# EAGLE design platine2 (EAGLE 4.16)
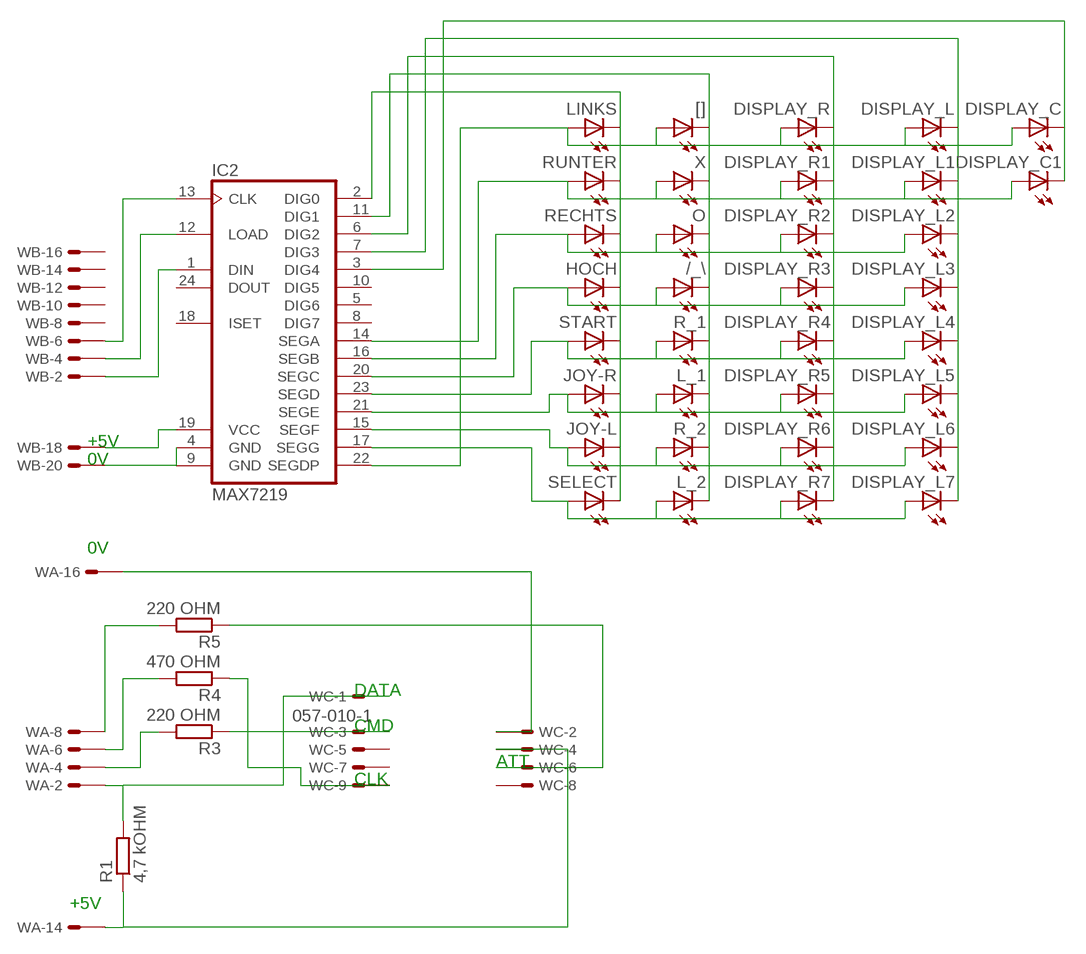
[diagram p0: schematic, sheet 1]

## Parts
/_\  LED5MM  [LED5MM]
[]  LED5MM  [LED5MM]
DISPLAY_C  LED5MM  [LED5MM]
DISPLAY_C1  LED5MM  [LED5MM]
DISPLAY_L  LED5MM  [LED5MM]
DISPLAY_L1  LED5MM  [LED5MM]
DISPLAY_L2  LED5MM  [LED5MM]
DISPLAY_L3  LED5MM  [LED5MM]
DISPLAY_L4  LED5MM  [LED5MM]
DISPLAY_L5  LED5MM  [LED5MM]
DISPLAY_L6  LED5MM  [LED5MM]
DISPLAY_L7  LED5MM  [LED5MM]
DISPLAY_R  LED5MM  [LED5MM]
DISPLAY_R1  LED5MM  [LED5MM]
DISPLAY_R2  LED5MM  [LED5MM]
DISPLAY_R3  LED5MM  [LED5MM]
DISPLAY_R4  LED5MM  [LED5MM]
DISPLAY_R5  LED5MM  [LED5MM]
DISPLAY_R6  LED5MM  [LED5MM]
DISPLAY_R7  LED5MM  [LED5MM]
HOCH  LED5MM  [LED5MM]
IC2  MAX7219  MAX7219CNG  [DIL24-3]
JOY-L  LED5MM  [LED5MM]
JOY-R  LED5MM  [LED5MM]
L_1  LED5MM  [LED5MM]
L_2  LED5MM  [LED5MM]
LINKS  LED5MM  [LED5MM]
O  LED5MM  [LED5MM]
R1  4,7 kOHM  R-R0805  [R0805]
R3  220 OHM  R-R0805  [R0805]
R4  470 OHM  R-R0805  [R0805]
R5  220 OHM  R-R0805  [R0805]
R_1  LED5MM  [LED5MM]
R_2  LED5MM  [LED5MM]
RECHTS  LED5MM  [LED5MM]
RUNTER  LED5MM  [LED5MM]
SELECT  LED5MM  [LED5MM]
START  LED5MM  [LED5MM]
WA  057-016-1  [057-016-1]
WB  057-020-1  [057-020-1]
WC  057-010-1  [057-010-1]
X  LED5MM  [LED5MM]

## Nets
N$1: R1.2 WA.2 WC.1
N$3: R3.2 WA.4
N$4: R4.2 WA.6
N$5: R5.2 WA.8
N$6: R1.1 WA.14 WC.4
N$11: IC2.4(GND) IC2.9(GND) WB.20
N$16: R3.1 WC.3
N$17: R4.1 WC.9
N$18: R5.1 WC.6
N$19: WA.16 WC.2
N$20: IC2.19(VCC) WB.18
N$21: IC2.1(DIN) WB.2
N$22: IC2.12(LOAD) WB.4
N$23: IC2.13(CLK) WB.6
N$31: [].A DISPLAY_C.A DISPLAY_L.A DISPLAY_R.A IC2.22(SEGDP) LINKS.A
N$32: DISPLAY_C1.A DISPLAY_L1.A DISPLAY_R1.A IC2.14(SEGA) RUNTER.A X.A
N$33: DISPLAY_L2.A DISPLAY_R2.A IC2.16(SEGB) O.A RECHTS.A
N$34: /_\.A DISPLAY_L3.A DISPLAY_R3.A HOCH.A IC2.20(SEGC)
N$35: DISPLAY_L4.A DISPLAY_R4.A IC2.23(SEGD) R_1.A START.A
N$36: DISPLAY_L5.A DISPLAY_R5.A IC2.21(SEGE) JOY-R.A L_1.A
N$37: DISPLAY_L6.A DISPLAY_R6.A IC2.15(SEGF) JOY-L.A R_2.A
N$38: DISPLAY_L7.A DISPLAY_R7.A IC2.17(SEGG) L_2.A SELECT.A
N$39: HOCH.K(C) IC2.2(DIG0) JOY-L.K(C) JOY-R.K(C) LINKS.K(C) RECHTS.K(C) RUNTER.K(C) SELECT.K(C) START.K(C)
N$40: /_\.K(C) [].K(C) IC2.11(DIG1) L_1.K(C) L_2.K(C) O.K(C) R_1.K(C) R_2.K(C) X.K(C)
N$41: DISPLAY_R1.K(C) DISPLAY_R2.K(C) DISPLAY_R3.K(C) DISPLAY_R4.K(C) DISPLAY_R5.K(C) DISPLAY_R6.K(C) DISPLAY_R7.K(C) DISPLAY_R.K(C) IC2.6(DIG2)
N$42: DISPLAY_L1.K(C) DISPLAY_L2.K(C) DISPLAY_L3.K(C) DISPLAY_L4.K(C) DISPLAY_L5.K(C) DISPLAY_L6.K(C) DISPLAY_L7.K(C) DISPLAY_L.K(C) IC2.7(DIG3)
N$43: DISPLAY_C1.K(C) DISPLAY_C.K(C) IC2.3(DIG4)
Unconnected: IC2.5(DIG6) IC2.8(DIG7) IC2.10(DIG5) IC2.18(ISET) IC2.24(DOUT) WA.1 WA.3 WA.5 WA.7 WA.9 WA.10 WA.11 WA.12 WA.13 WA.15 WB.1 WB.3 WB.5 WB.7 WB.8 WB.9 WB.10 WB.11 WB.12 WB.13 WB.14 WB.15 WB.16 WB.17 WB.19 WC.5 WC.7 WC.8 WC.10

## Notes on the sheet
- +5V
- 0V
- 0V
- DATA
- CMD
- ATT
- CLK
- +5V

## Library data of the parts
/_\ [] DISPLAY_C DISPLAY_C1 DISPLAY_L DISPLAY_L1-DISPLAY_L7 DISPLAY_R DISPLAY_R1-DISPLAY_R7 HOCH JOY-L JOY-R L_1 L_2 LINKS O R_1 R_2 RECHTS RUNTER SELECT START X = led:LED: LED OSRAM: - CHIPLED LG R971, LG N971, LY N971, LG Q971, LY Q971, LO R971, LY R971 LH N974, LH R974 LS Q976, LO Q976, LY Q976 LO Q996 - Hyper CHIPLED LW Q18S LB Q993, LB Q99A, LB R99A - SideLED LS A670, LO A670, LY A670, LG A670, LP A670 LB A673, LV A673, LT A673, LW A673 LH A674 LY A675 LS A676, LA A676, LO A676, LY A676, LW A676 LS A679, LY A679, LG A679 - Hyper Micro SIDELED® LS Y876, LA Y876, LO Y876, LY Y876 LT Y87S - SmartLED LW L88C, LW L88S LB L89C, LB L89S, LG L890 LS L89K, LO L89K, LY L89K LS L896, LA L896, LO L896, LY L896 - TOPLED LS T670, LO T670, LY T670, LG T670, LP T670 LSG T670, LSP T670, LSY T670, LOP T670, LYG T670 LG T671, LOG T671, LSG T671 LB T673, LV T673, LT T673, LW T673 LH T674 LS T676, LA T676, LO T676, LY T676, LB T676, LH T676, LSB T676, LW T676 LB T67C, LV T67C, LT T67C, LS T67K, LO T67K, LY T67K, LW E67C LS E67B, LA E67B, LO E67B, LY E67B, LB E67C, LV E67C, LT E67C LW T67C LS T679, LY T679, LG T679 LS T770, LO T770, LY T770, LG T770, LP T770 LB T773, LV T773, LT T773, LW T773 LH T774 LS E675, LA E675, LY E675, LS T675 LS T776, LA T776, LO T776, LY T776, LB T776 LHGB T686 LT T68C, LB T68C - Hyper Mini TOPLED® LB M676 - Mini TOPLED Santana® LG M470 LS M47K, LO M47K, LY M47K Source: http://www.osram.convergy.de - LUMILED® LXK2-PW12-R00, LXK2-PW12-S00, LXK2-PW14-U00, LXK2-PW14-V00 LXK2-PM12-R00, LXK2-PM12-S00, LXK2-PM14-U00 LXK2-PE12-Q00, LXK2-PE12-R00, LXK2-PE12-S00, LXK2-PE14-T00, LXK2-PE14-U00 LXK2-PB12-K00, LXK2-PB12-L00, LXK2-PB12-M00, LXK2-PB14-N00, LXK2-PB14-P00, LXK2-PB14-Q00 LXK2-PR12-L00, LXK2-PR12-M00, LXK2-PR14-Q00, LXK2-PR14-R00 LXK2-PD12-Q00, LXK2-PD12-R00, LXK2-PD12-S00 LXK2-PH12-R00, LXK2-PH12-S00 LXK2-PL12-P00, LXK2-PL12-Q00, LXK2-PL12-R00 Source: www.luxeon.com
IC2 = maxim:MAX7219CNG: LED DISPLAY DRIVER
R1 R3-R5 = quantum-sensor:R: Resistor
WA = con-panduit:057-016-: CONNECTOR 10-pin series 057 contact pc board low profile headers
WB = con-panduit:057-020-: CONNECTOR 20-pin series 057 contact pc board low profile headers
WC = con-panduit:057-010-: CONNECTOR 10-pin series 057 contact pc board low profile headers

## Board
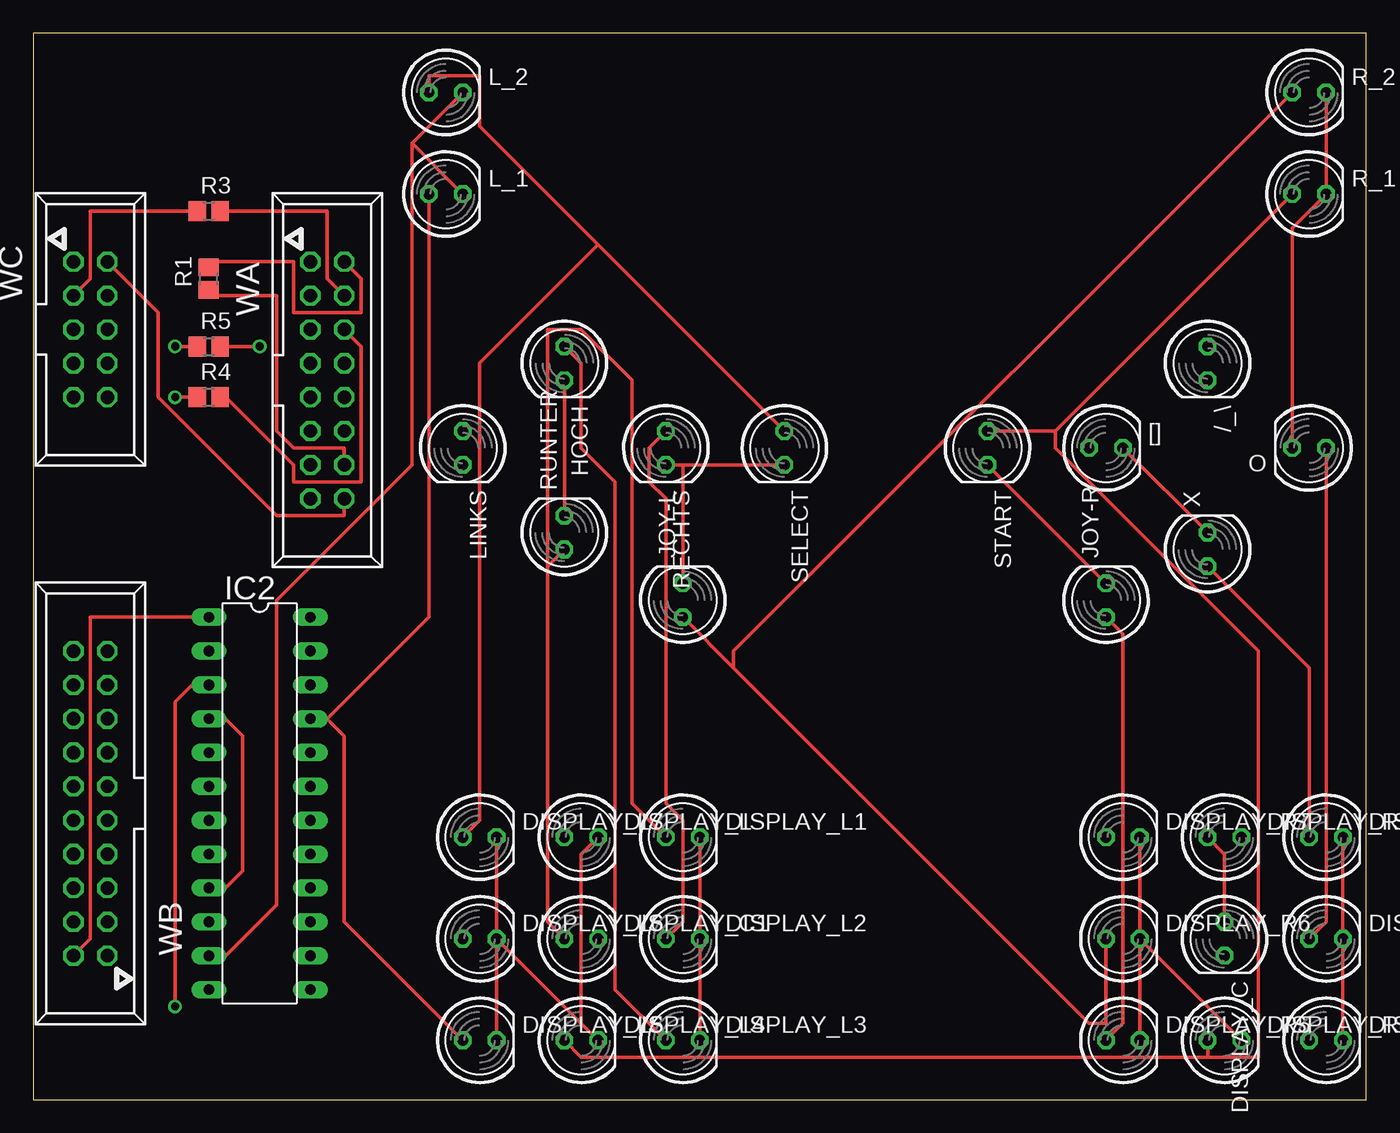
[diagram p1: board, top side]
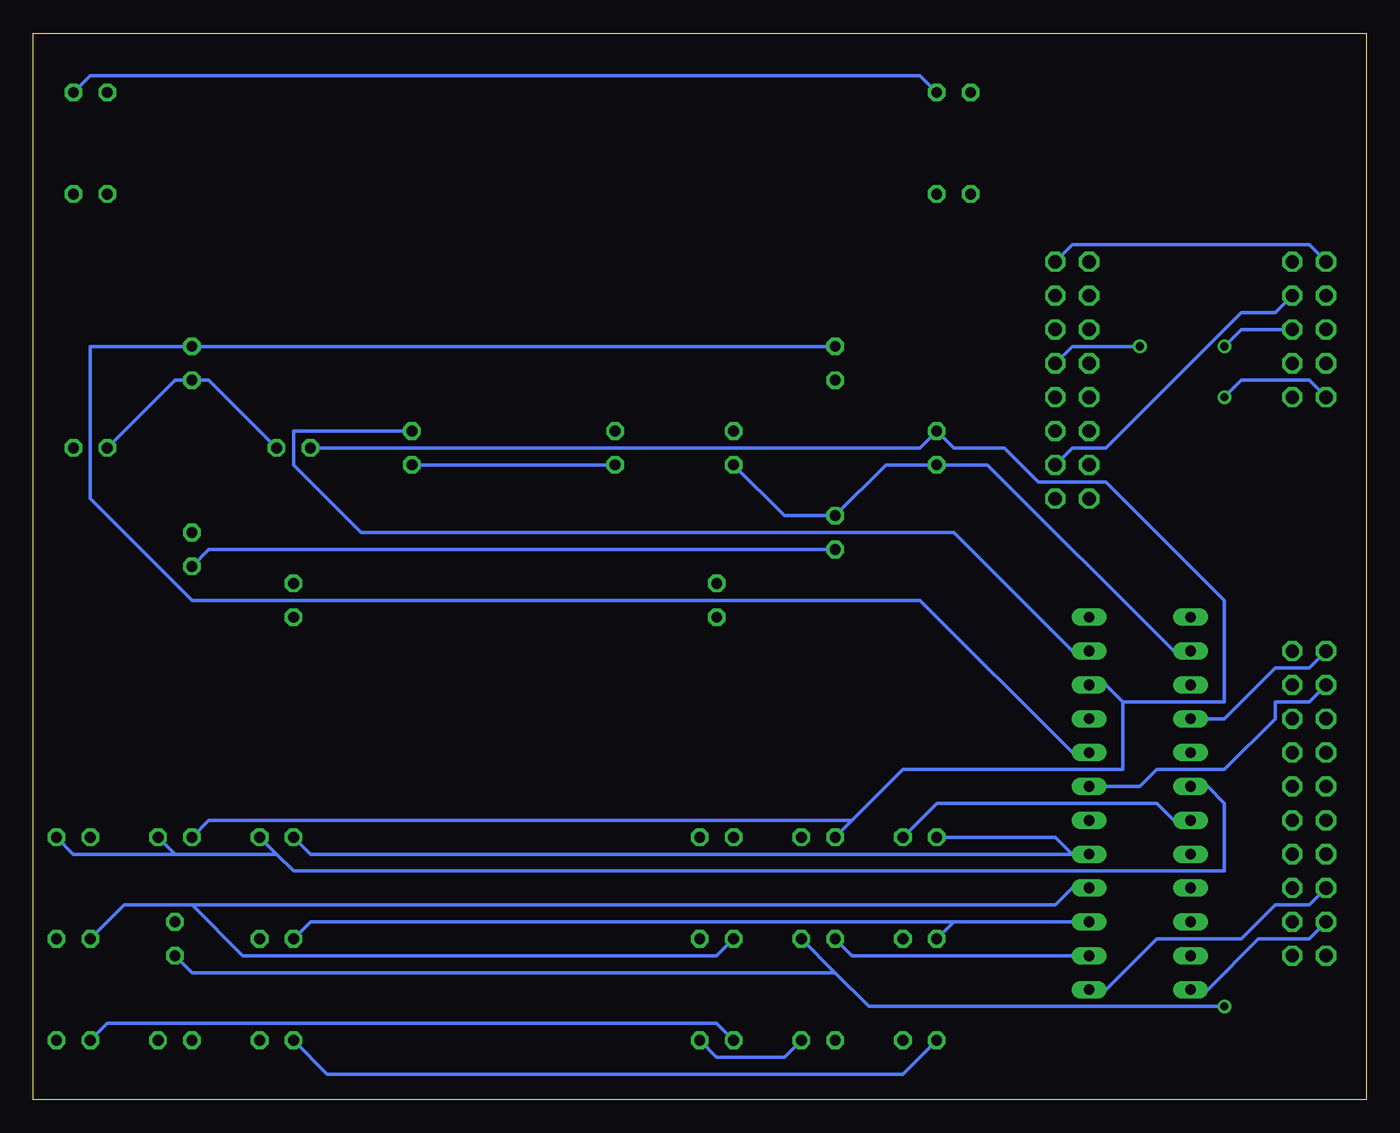
[diagram p2: board, bottom side, seen from below]

Size 100 x 80 mm. Coordinates in mm from the lower left corner, seen from the top.
Outline: 0,0 100,0 100,80 0,80 0,0
Copper layers (1*16): Top 0.035mm / dielectric 1.5mm / Bottom 0.035mm
Design rules "default": minimum track width 10mil, minimum drill 24mil, track to track 8mil, track to pad 8mil, pad to pad 8mil, via to via 8mil, smd to smd 8mil, copper to edge 40mil, drill to drill 8mil, minimum pad ring 10mil, minimum via ring 8mil, stop-mask expansion 4mil, vias tented up to drill 0mil, thermal gap 10mil

### Footprints (pad centres in the part's own frame; a part is rotated, then mirrored left to right if it is on the bottom)
LED5MM = drill 0.813 octagon: A -1.27,0; K 1.27,0
DIL24-3 = drill 0.813 long: 1 -13.97,-3.81; 2 -11.43,-3.81; 3 -8.89,-3.81; 4 -6.35,-3.81; 5 -3.81,-3.81; 6 -1.27,-3.81; 7 1.27,-3.81; 8 3.81,-3.81; 9 6.35,-3.81; 10 8.89,-3.81; 11 11.43,-3.81; 12 13.97,-3.81; 13 13.97,3.81; 14 11.43,3.81; 15 8.89,3.81; 16 6.35,3.81; 17 3.81,3.81; 18 1.27,3.81; 19 -1.27,3.81; 20 -3.81,3.81; 21 -6.35,3.81; 22 -8.89,3.81; 23 -11.43,3.81; 24 -13.97,3.81
R0805 = smd 1.3 x 1.5: 1 -0.85,0; 2 0.85,0
057-016-1 = drill 1 octagon: 1 -8.89,-1.27; 2 -8.89,1.27; 3 -6.35,-1.27; 4 -6.35,1.27; 5 -3.81,-1.27; 6 -3.81,1.27; 7 -1.27,-1.27; 8 -1.27,1.27; 9 1.27,-1.27; 10 1.27,1.27; 11 3.81,-1.27; 12 3.81,1.27; 13 6.35,-1.27; 14 6.35,1.27; 15 8.89,-1.27; 16 8.89,1.27
057-020-1 = drill 1 octagon: 1 -11.43,-1.27; 2 -11.43,1.27; 3 -8.89,-1.27; 4 -8.89,1.27; 5 -6.35,-1.27; 6 -6.35,1.27; 7 -3.81,-1.27; 8 -3.81,1.27; 9 -1.27,-1.27; 10 -1.27,1.27; 11 1.27,-1.27; 12 1.27,1.27; 13 3.81,-1.27; 14 3.81,1.27; 15 6.35,-1.27; 16 6.35,1.27; 17 8.89,-1.27; 18 8.89,1.27; 19 11.43,-1.27; 20 11.43,1.27
057-010-1 = drill 1 octagon: 1 -5.08,-1.27; 2 -5.08,1.27; 3 -2.54,-1.27; 4 -2.54,1.27; 5 0,-1.27; 6 0,1.27; 7 2.54,-1.27; 8 2.54,1.27; 9 5.08,-1.27; 10 5.08,1.27

### Placement (x,y rotation side)
/_\  88.1,55.24 270 top
[]  80.48,48.89 0 top
DISPLAY_C  89.37,12.06 270 top
DISPLAY_C1  41.11,12.06 0 top
DISPLAY_L  41.11,19.68 0 top
DISPLAY_L1  48.73,19.68 0 top
DISPLAY_L2  48.73,12.06 0 top
DISPLAY_L3  48.73,4.44 0 top
DISPLAY_L4  41.11,4.44 0 top
DISPLAY_L5  33.49,4.44 0 top
DISPLAY_L6  33.49,12.06 0 top
DISPLAY_L7  33.49,19.68 0 top
DISPLAY_R  89.37,19.68 0 top
DISPLAY_R1  96.99,19.68 0 top
DISPLAY_R2  96.99,12.06 0 top
DISPLAY_R3  96.99,4.44 0 top
DISPLAY_R4  89.37,4.44 0 top
DISPLAY_R5  81.75,4.44 0 top
DISPLAY_R6  81.75,12.06 0 top
DISPLAY_R7  81.75,19.68 0 top
HOCH  39.84,55.24 270 top
IC2  16.98,22.22 270 top
JOY-L  48.73,37.46 90 top
JOY-R  80.48,37.46 90 top
L_1  30.95,67.94 0 top
L_2  30.95,75.56 0 top
LINKS  32.22,48.89 270 top
O  95.72,48.89 180 top
R1  13.17,61.59 90 top
R3  13.17,66.67 0 top
R4  13.17,52.7 0 top
R5  13.17,56.51 0 top
R_1  95.72,67.94 0 top
R_2  95.72,75.56 0 top
RECHTS  47.46,48.89 270 top
RUNTER  39.84,42.54 90 top
SELECT  56.35,48.89 270 top
START  71.59,48.89 270 top
WA  22.06,53.97 270 top
WB  4.28,22.22 90 top
WC  4.28,57.78 270 top
X  88.1,41.27 90 top

### Tracks (layer width: path | path; a pad name or v marks a point on that pad's centre or on a via)
N$1
  Top 0.254: WA.2 24.6,61.59 24.6,59.05 19.52,59.05 19.52,62.86 13.17,62.86 R1.2
  Bottom 0.254: WC.1 4.28,64.13 22.06,64.13 WA.2
N$3
  Top 0.254: WA.4 22.06,61.59 22.06,66.67 R3.2
N$4
  Top 0.254: WA.6 24.6,56.51 24.6,46.35 19.52,46.35 19.52,47.62 14.44,52.7 R4.2
N$5  (via drill 0.61)
  Top 0.254: R5.2 v16.98,56.51
  Bottom 0.254: v16.98,56.51 22.06,56.51 WA.8
N$6
  Top 0.254: WA.14 23.33,48.89 19.52,48.89 18.25,50.16 18.25,60.32 13.17,60.32 R1.1
  Bottom 0.254: WC.4 6.82,59.05 9.36,59.05 19.52,48.89 22.06,48.89 WA.14
N$11
  Top 0.254: IC2.9 14.44,15.87 15.71,17.14 15.71,27.3 14.44,28.57 IC2.4
  Bottom 0.254: WB.20 4.28,32.38 6.82,32.38 10.63,28.57 IC2.4
N$16
  Top 0.254: WC.3 4.28,61.59 4.28,66.67 R3.1
N$17  (via drill 0.61)
  Top 0.254: v10.63,52.7 R4.1
  Bottom 0.254: v10.63,52.7 9.36,53.97 4.28,53.97 WC.9
N$18  (via drill 0.61)
  Top 0.254: v10.63,56.51 R5.1
  Bottom 0.254: v10.63,56.51 9.36,57.78 WC.6
N$19
  Top 0.254: WC.2 9.36,59.05 9.36,52.7 18.25,43.81 23.33,43.81 WA.16
N$20
  Bottom 0.254: WB.18 4.28,29.84 6.82,29.84 6.82,28.57 10.63,24.76 15.71,24.76 16.98,23.49 IC2.19
N$21
  Top 0.254: WB.2 4.28,12.06 4.28,36.19 IC2.1
N$22
  Bottom 0.254: WB.4 4.28,12.06 8.09,12.06 11.9,8.25 IC2.12
N$23
  Bottom 0.254: WB.6 4.28,14.6 6.82,14.6 9.36,12.06 15.71,12.06 19.52,8.25 IC2.13
N$31
  Top 0.254: DISPLAY_R.A 89.37,18.41 DISPLAY_C.A
  Bottom 0.254: [].A 33.49,48.89 LINKS.A 30.95,48.89 27.14,48.89 24.6,46.35 19.52,46.35 10.63,37.46 10.63,29.84 18.25,29.84 | 18.25,29.84 19.52,31.11 IC2.22 | 18.25,29.84 18.25,24.76 34.76,24.76 38.57,20.95 | 38.57,20.95 DISPLAY_L.A | DISPLAY_R.A 86.83,20.95 38.57,20.95
N$32
  Top 0.254: X.A 95.72,32.38 DISPLAY_R1.A | 38.57,40 RUNTER.A | 38.57,40 38.57,13.33 DISPLAY_C1.A | DISPLAY_L1.A 44.92,22.22 44.92,53.97 41.11,57.78 38.57,57.78 38.57,40
  Bottom 0.254: DISPLAY_C1.A 38.57,10.79 IC2.14 | X.A 86.83,41.27 RUNTER.A
N$33
  Top 0.254: O.A 96.99,13.33 DISPLAY_R2.A | RECHTS.A 46.19,48.89 46.19,46.35 47.46,45.08 47.46,22.22 48.73,20.95 48.73,13.33 DISPLAY_L2.A
  Bottom 0.254: 88.1,14.6 93.18,14.6 DISPLAY_R2.A | 88.1,14.6 23.33,14.6 22.06,15.87 IC2.16 | DISPLAY_L2.A 48.73,10.79 84.29,10.79 88.1,14.6
N$34
  Top 0.254: DISPLAY_L3.A 43.65,8.25 43.65,46.35 41.11,48.89 41.11,55.24 HOCH.A
  Bottom 0.254: DISPLAY_L3.A 48.73,5.71 94.45,5.71 DISPLAY_R3.A | IC2.20 22.06,26.03 33.49,37.46 88.1,37.46 95.72,45.08 95.72,56.51 /_\.A HOCH.A
N$35
  Top 0.254: DISPLAY_L4.A 41.11,3.17 88.1,3.17 | 88.1,3.17 DISPLAY_R4.A | 76.67,50.16 R_1.A | 76.67,50.16 START.A | 88.1,3.17 91.91,3.17 91.91,33.65 76.67,48.89 76.67,50.16
  Bottom 0.254: START.A 80.48,50.16 80.48,47.62 75.4,42.54 30.95,42.54 22.06,33.65 IC2.23
N$36
  Top 0.254: DISPLAY_R5.A 81.75,5.71 81.75,34.92 JOY-R.A | DISPLAY_L5.A 23.33,13.33 23.33,27.3 22.06,28.57 | L_1.A 29.68,36.19 22.06,28.57 | 22.06,28.57 IC2.21
  Bottom 0.254: DISPLAY_R5.A 77.94,1.9 34.76,1.9 DISPLAY_L5.A
N$37
  Top 0.254: 52.54,32.38 79.21,5.71 80.48,5.71 DISPLAY_R6.A | 52.54,32.38 JOY-L.A | R_2.A 52.54,33.65 52.54,32.38
  Bottom 0.254: 30.95,13.33 DISPLAY_L6.A | IC2.15 30.95,13.33 | DISPLAY_R6.A 79.21,13.33 30.95,13.33
N$38
  Top 0.254: 42.38,64.13 33.49,73.02 33.49,76.83 29.68,76.83 L_2.A | 42.38,64.13 SELECT.A | 42.38,64.13 33.49,55.24 33.49,20.95 DISPLAY_L7.A
  Bottom 0.254: 22.06,18.41 23.33,19.68 DISPLAY_L7.A | DISPLAY_R7.A 79.21,18.41 22.06,18.41 | IC2.17 22.06,18.41
N$39
  Top 0.254: START.K JOY-R.K | 48.73,47.62 SELECT.K | RECHTS.K 48.73,47.62 | 48.73,47.62 JOY-L.K | RUNTER.K HOCH.K
  Bottom 0.254: IC2.2 14.44,33.65 28.41,47.62 LINKS.K 36.03,47.62 RUNTER.K 43.65,43.81 RECHTS.K | SELECT.K START.K
N$40
  Top 0.254: R_2.K R_1.K 94.45,65.4 O.K | [].K X.K | 28.41,71.75 28.41,47.62 18.25,37.46 18.25,14.6 14.44,10.79 IC2.11 | 28.41,71.75 L_2.K | 28.41,71.75 L_1.K
  Bottom 0.254: [].K 86.83,53.97 /_\.K 89.37,53.97 O.K | R_2.K 95.72,76.83 33.49,76.83 L_2.K
N$41
  Top 0.254: DISPLAY_R3.K DISPLAY_R2.K DISPLAY_R1.K | DISPLAY_R6.K DISPLAY_R5.K | DISPLAY_R6.K DISPLAY_R4.K | DISPLAY_R7.K DISPLAY_R6.K
  Bottom 0.254: 81.75,18.41 DISPLAY_R7.K | 81.75,18.41 80.48,17.14 10.63,17.14 10.63,22.22 11.9,23.49 IC2.6 | 89.37,18.41 DISPLAY_R.K | 81.75,18.41 89.37,18.41 | DISPLAY_R1.K 96.99,18.41 89.37,18.41
N$42
  Top 0.254: DISPLAY_L3.K DISPLAY_L2.K DISPLAY_L1.K | DISPLAY_L6.K DISPLAY_L5.K | DISPLAY_L7.K DISPLAY_L6.K | DISPLAY_L6.K 41.11,5.71 | 41.11,5.71 DISPLAY_L4.K | DISPLAY_L.K 41.11,18.41 41.11,5.71
  Bottom 0.254: DISPLAY_L7.K 32.22,22.22 15.71,22.22 14.44,20.95 IC2.7 | DISPLAY_L3.K 48.73,3.17 43.65,3.17 DISPLAY_L4.K
N$43  (via drill 0.61)
  Top 0.254: v10.63,6.98 10.63,29.84 11.9,31.11 IC2.3
  Bottom 0.254: v10.63,6.98 37.3,6.98 39.84,9.52 | 39.84,9.52 DISPLAY_C1.K | DISPLAY_C.K 88.1,9.52 39.84,9.52